# EAGLE design matrixdriver_test_rev1a (EAGLE 4.16)
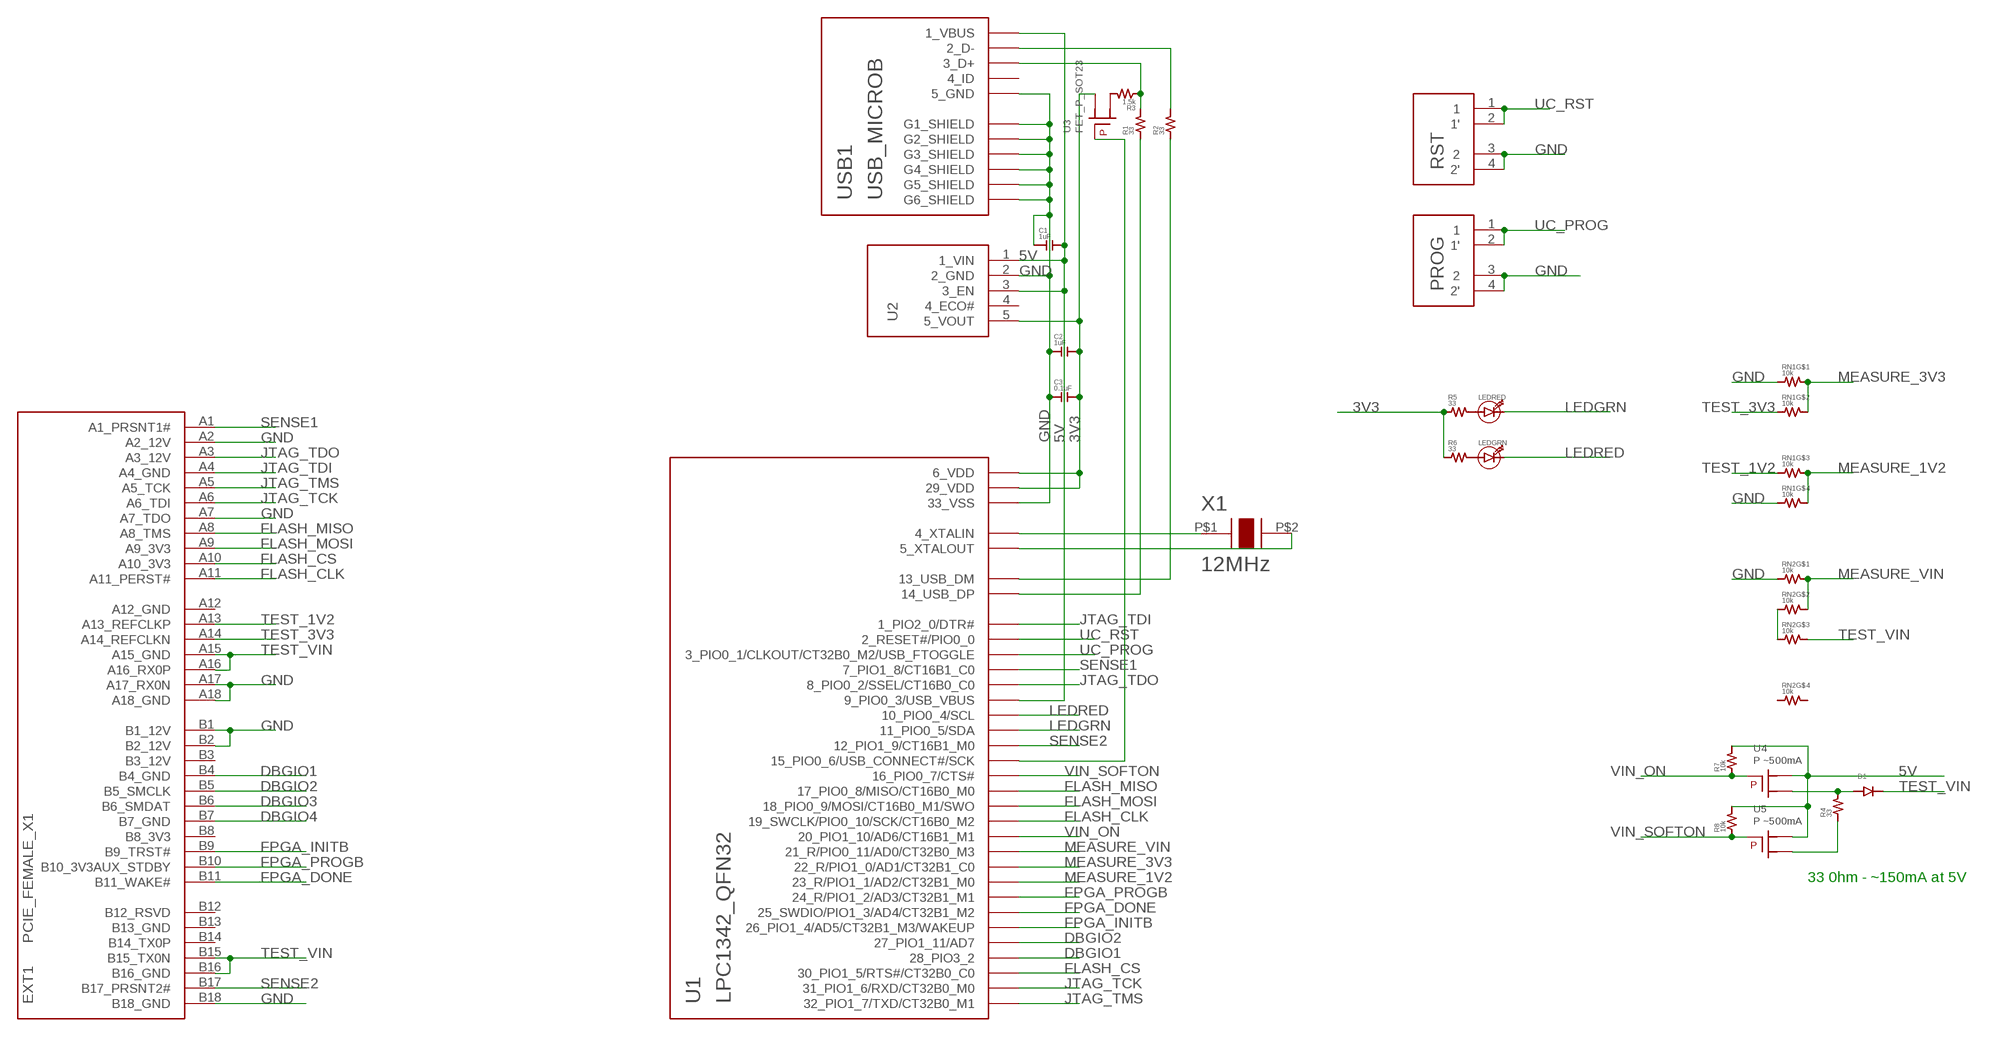
[diagram p0: schematic, sheet 1]

## Parts
C1  1uF  CAP0603  [0603]
C2  1uF  CAP0603  [0603]
C3  0.1uF  CAP0603  [0603]
D1  DIODE0603  [0603_DIODE]
EXT1  PCIE_FEMALE_X1  [PCIE_X1_FEMALE_THROUGHHOLE]
LEDGRN  LED0603  [0603_DIODE]
LEDRED  LED0603  [0603_DIODE]
PROG  SW_SPST4PTS810  [SW_PTS810]
R1  33  RES0603  [0603]
R2  33  RES0603  [0603]
R3  1.5k  RES0603  [0603]
R4  33  RES0603  [0603]
R5  33  RES0603  [0603]
R6  33  RES0603  [0603]
R7  10k  RES0603  [0603]
R8  10k  RES0603  [0603]
RN1  10k  RN4YC164  [RN4_YC164]
RN2  10k  RN4YC164  [RN4_YC164]
RST  SW_SPST4PTS810  [SW_PTS810]
U1  LPC1342_QFN32  [QFN32PAD_.65MM_7X7]
U2  VREG_LDO  [SOT-23-5]
U3  FET_P_SOT23  [SOT-23-3-FET]
U4  P ~500mA  FET_P_SOT23  [SOT-23-3-FET]
U5  P ~500mA  FET_P_SOT23  [SOT-23-3-FET]
USB1  USB_MICROB  [USB_MICROB_FEMALE_FCI_10103594]
X1  12MHz  CRYSTAL5MM_3.2MM  [X_5MM_3.2MM]

## Nets
3V3: C2.2 C3.2 R5.1 R6.1 U1.6(6_VDD) U1.29(29_VDD) U2.5(5_VOUT) U3.S
5V: C1.2 R7.2 R8.2 U1.9(9_PIO0_3/USB_VBUS) U2.1(1_VIN) U2.3(3_EN) U4.S U5.S USB1.1(1_VBUS)
DBGIO1: EXT1.B4(B4_GND) U1.28(28_PIO3_2)
DBGIO2: EXT1.B5(B5_SMCLK) U1.27(27_PIO1_11/AD7)
DBGIO3: EXT1.B6(B6_SMDAT)
DBGIO4: EXT1.B7(B7_GND)
FLASH_CLK: EXT1.A11(A11_PERST#) U1.19(19_SWCLK/PIO0_10/SCK/CT16B0_M2)
FLASH_CS: EXT1.A10(A10_3V3) U1.30(30_PIO1_5/RTS#/CT32B0_C0)
FLASH_MISO: EXT1.A8(A8_TMS) U1.17(17_PIO0_8/MISO/CT16B0_M0)
FLASH_MOSI: EXT1.A9(A9_3V3) U1.18(18_PIO0_9/MOSI/CT16B0_M1/SWO)
FPGA_DONE: EXT1.B11(B11_WAKE#) U1.25(25_SWDIO/PIO1_3/AD4/CT32B1_M2)
FPGA_INITB: EXT1.B9(B9_TRST#) U1.26(26_PIO1_4/AD5/CT32B1_M3/WAKEUP)
FPGA_PROGB: EXT1.B10(B10_3V3AUX_STDBY) U1.24(24_R/PIO1_2/AD3/CT32B1_M1)
GND: C1.1 C2.1 C3.1 EXT1.A2(A2_12V) EXT1.A7(A7_TDO) EXT1.A17(A17_RX0N) EXT1.A18(A18_GND) EXT1.B1(B1_12V) EXT1.B2(B2_12V) EXT1.B18(B18_GND) PROG.3 PROG.4(2') RN1.P$1 RN1.P$4 RN2.P$1 RST.3 RST.4(2') U1.33(33_VSS) U2.2(2_GND) USB1.5(5_GND) USB1.G1(G1_SHIELD) USB1.G2(G2_SHIELD) USB1.G3(G3_SHIELD) USB1.G4(G4_SHIELD) USB1.G5(G5_SHIELD) USB1.G6(G6_SHIELD)
JTAG_TCK: EXT1.A6(A6_TDI) U1.31(31_PIO1_6/RXD/CT32B0_M0)
JTAG_TDI: EXT1.A4(A4_GND) U1.1(1_PIO2_0/DTR#)
JTAG_TDO: EXT1.A3(A3_12V) U1.8(8_PIO0_2/SSEL/CT16B0_C0)
JTAG_TMS: EXT1.A5(A5_TCK) U1.32(32_PIO1_7/TXD/CT32B0_M1)
LEDGRN: LEDRED.- U1.11(11_PIO0_5/SDA)
LEDRED: LEDGRN.- U1.10(10_PIO0_4/SCL)
MEASURE_1V2: RN1.P$5 RN1.P$6 U1.23(23_R/PIO1_1/AD2/CT32B1_M0)
MEASURE_3V3: RN1.P$7 RN1.P$8 U1.22(22_R/PIO1_0/AD1/CT32B1_C0)
MEASURE_VIN: RN2.P$7 RN2.P$8 U1.21(21_R/PIO0_11/AD0/CT32B0_M3)
N$1: R3.2 U3.D
N$2: R2.2 USB1.2(2_D-)
N$3: R1.2 R3.1 USB1.3(3_D+)
N$4: U1.15(15_PIO0_6/USB_CONNECT#/SCK) U3.G
N$5: R2.1 U1.13(13_USB_DM)
N$6: R1.1 U1.14(14_USB_DP)
N$7: LEDRED.+ R5.2
N$8: U1.4(4_XTALIN) X1.P$1
N$9: U1.5(5_XTALOUT) X1.P$2
N$10: LEDGRN.+ R6.2
N$11: D1.+ R4.2 U4.D
N$13: R4.1 U5.D
N$17: RN2.P$2 RN2.P$3
SENSE1: EXT1.A1(A1_PRSNT1#) U1.7(7_PIO1_8/CT16B1_C0)
SENSE2: EXT1.B17(B17_PRSNT2#) U1.12(12_PIO1_9/CT16B1_M0)
TEST_1V2: EXT1.A13(A13_REFCLKP) RN1.P$3
TEST_3V3: EXT1.A14(A14_REFCLKN) RN1.P$2
TEST_VIN: D1.- EXT1.A15(A15_GND) EXT1.A16(A16_RX0P) EXT1.B15(B15_TX0N) EXT1.B16(B16_GND) RN2.P$6
UC_PROG: PROG.1 PROG.2(1') U1.3(3_PIO0_1/CLKOUT/CT32B0_M2/USB_FTOGGLE)
UC_RST: RST.1 RST.2(1') U1.2(2_RESET#/PIO0_0)
VIN_ON: R7.1 U1.20(20_PIO1_10/AD6/CT16B1_M1) U4.G
VIN_SOFTON: R8.1 U1.16(16_PIO0_7/CTS#) U5.G
Unconnected: EXT1.A12(A12_GND) EXT1.B3(B3_12V) EXT1.B8(B8_3V3) EXT1.B12(B12_RSVD) EXT1.B13(B13_GND) EXT1.B14(B14_TX0P) RN2.P$4 RN2.P$5 U2.4(4_ECO#) USB1.4(4_ID)

## Notes on the sheet
- 33 0hm - ~150mA at 5V

## Library data of the parts
C1-C3 = _sg_lib:CAP0603
D1 = _sg_lib:DIODE0603
EXT1 = _sg_lib:PCIE_FEMALE_X1
LEDGRN LEDRED = _sg_lib:LED0603
PROG RST = _sg_lib:SW_SPST4
R1-R8 = _sg_lib:RES0603
RN1 RN2 = _sg_lib:RN4
U1 = _sg_lib:LPC1342_QFN32
U2 = _sg_lib:VREG_LDO
U3-U5 = _sg_lib:FET_P_SOT23
USB1 = _sg_lib:USB_MICROB
X1 = _sg_misc:CRYSTAL

## Board
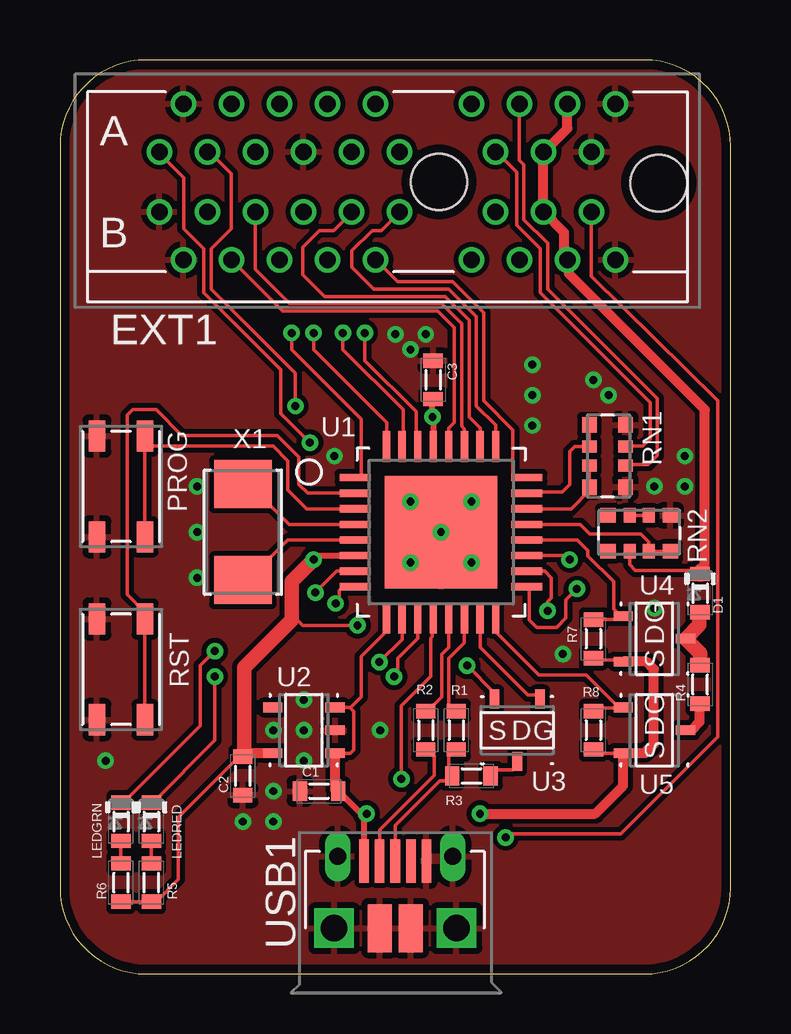
[diagram p1: board, top side]
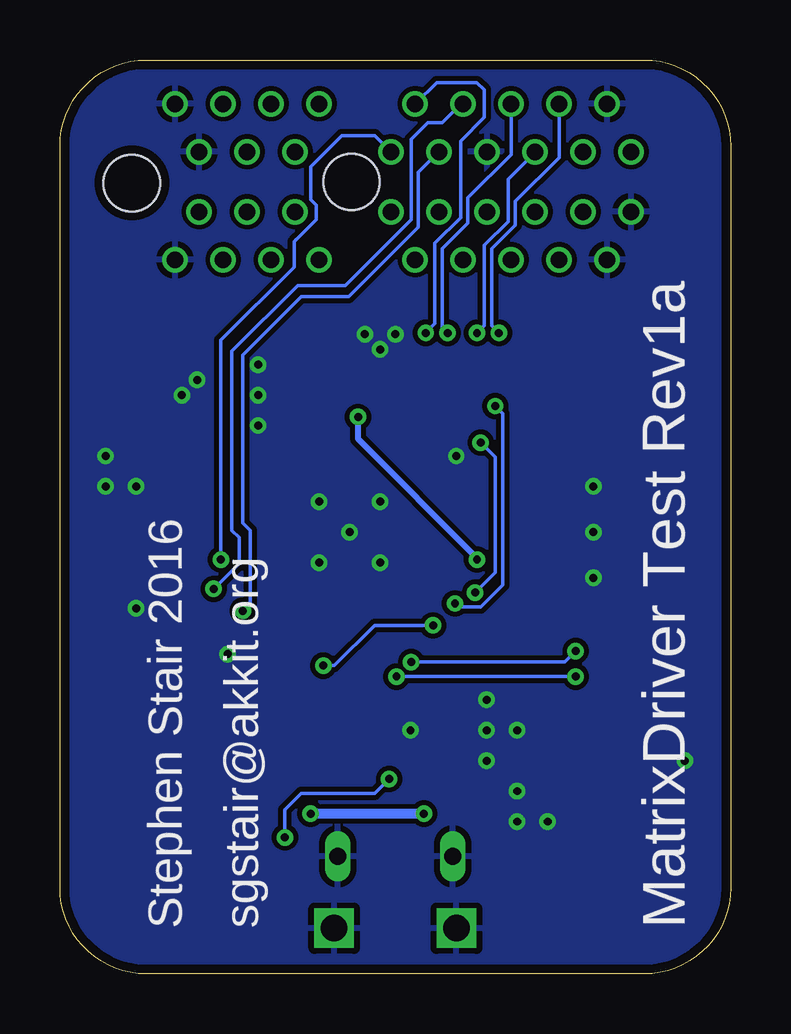
[diagram p2: board, bottom side, seen from below]

Size 27.94 x 38.1 mm. Coordinates in mm from the lower left corner, seen from the top.
Outline: 24.35,0 arc90 27.94,3.59 27.94,34.51 arc90 24.35,38.1 3.59,38.1 arc90 0,34.51 0,3.59 arc90 3.59,0 24.35,0
Copper layers (1*16): Top 0.0356mm / dielectric 1.5011mm / Bottom 0.0356mm
Design rules "LaenPCBOrder": minimum track width 6mil, minimum drill 13mil, track to track 6mil, track to pad 6mil, pad to pad 6mil, via to via 6mil, smd to smd 6mil, copper to edge 15mil, drill to drill 6mil, minimum pad ring 7mil, minimum via ring 7mil, stop-mask expansion 4mil, vias tented up to drill 25mil, thermal gap 10mil
tRestrict: area 18.3,18 to 18.6,18.7; area 13.2,18.2 to 13.4,18.8; area 15.6,20.9 to 16.3,21.2; area 15.7,15.7 to 16.2,15.8; area 18.3,15.6 to 18.7,16; area 13.2,15.7 to 13.5,16

### Footprints (pad centres in the part's own frame; a part is rotated, then mirrored left to right if it is on the bottom)
0603 = smd 0.6 x 0.8: 1 -0.8,0; 2 0.8,0
0603_DIODE = smd 0.6 x 0.8: + 0.8,0; - -0.8,0
PCIE_X1_FEMALE_THROUGHHOLE = drill 0.7 round: A1 -13,1.25; A2 -12,3.25; A3 -11,1.25; A4 -10,3.25; A5 -9,1.25; A6 -8,3.25; A7 -7,1.25; A8 -6,3.25; A9 -5,1.25; A10 -4,3.25; A11 -3,1.25; A12 0,3.25; A13 1,1.25; A14 2,3.25; A15 3,1.25; A16 4,3.25; A17 5,1.25; A18 6,3.25; B1 -13,-1.25; B2 -12,-3.25; B3 -11,-1.25; B4 -10,-3.25; B5 -9,-1.25; B6 -8,-3.25; B7 -7,-1.25; B8 -6,-3.25; B9 -5,-1.25; B10 -4,-3.25; B11 -3,-1.25; B12 0,-3.25; B13 1,-1.25; B14 2,-3.25; B15 3,-1.25; B16 4,-3.25; B17 5,-1.25; B18 6,-3.25 | hole 2.35: -1.35,0; 7.8,-0.05
SW_PTS810 = smd 1.3 x 0.7: 1 -2.1,1; 2 2.1,1; 3 -2.1,-1; 4 2.1,-1
RN4_YC164 = smd 0.65 x 0.6: P$1 -1.3,-0.7; P$4 1.3,-0.7; P$5 1.3,0.8; P$8 -1.3,0.8 | smd 0.5 x 0.6: P$2 -0.4,-0.7; P$3 0.4,-0.7; P$6 0.4,0.8; P$7 -0.4,0.8
QFN32PAD_.65MM_7X7 = smd 1.3 x 0.3: 1 -3.575,2.275; 2 -3.575,1.625; 3 -3.575,0.975; 4 -3.575,0.325; 5 -3.575,-0.325; 6 -3.575,-0.975; 7 -3.575,-1.625; 8 -3.575,-2.275; 17 3.575,-2.275; 18 3.575,-1.625; 19 3.575,-0.975; 20 3.575,-0.325; 21 3.575,0.325; 22 3.575,0.975; 23 3.575,1.625; 24 3.575,2.275 | smd 0.3 x 1.3: 9 -2.275,-3.575; 10 -1.625,-3.575; 11 -0.975,-3.575; 12 -0.325,-3.575; 13 0.325,-3.575; 14 0.975,-3.575; 15 1.625,-3.575; 16 2.275,-3.575; 25 2.275,3.575; 26 1.625,3.575; 27 0.975,3.575; 28 0.325,3.575; 29 -0.325,3.575; 30 -0.975,3.575; 31 -1.625,3.575; 32 -2.275,3.575 | smd 4.7 x 4.7: 33 0,0
SOT-23-5 = smd 0.8 x 0.4: 1 -1.3,0.95; 2 -1.3,0; 3 -1.3,-0.95; 4 1.3,-0.95; 5 1.3,0.95
SOT-23-3-FET = smd 0.8 x 0.4: D 1.3,0; G -1.3,0.95; S -1.3,-0.95
USB_MICROB_FEMALE_FCI_10103594 = smd 0.4 x 1.8: 1 -1.3,2.8; 2 -0.65,2.8; 3 0,2.8; 4 0.65,2.8; 5 1.3,2.8 | drill 0.7 long: G1 -2.4,3; G2 2.4,3 | smd 1 x 2: G3 -0.65,0; G4 0.65,0 | drill 1.1 square: G5 -2.55,0; G6 2.55,0
X_5MM_3.2MM = smd 2 x 2.4: P$1 -2,0; P$2 2,0

### Placement (x,y rotation side)
C1  10.8,7.62 0 top
C2  7.62,8.26 90 top
C3  15.54,24.77 270 top
D1  26.67,15.88 270 top
EXT1  17.15,33.02 0 top
LEDGRN  2.54,6.35 270 top
LEDRED  3.81,6.35 270 top
PROG  2.54,20.32 270 top
R1  16.51,10.16 270 top
R2  15.24,10.16 270 top
R3  17.15,8.26 0 top
R4  26.67,12.07 90 top
R5  3.81,3.81 90 top
R6  2.54,3.81 90 top
R7  22.23,13.97 270 top
R8  22.23,10.16 270 top
RN1  22.86,21.59 90 top
RN2  24.13,18.41 180 top
RST  2.54,12.7 270 top
U1  15.88,18.41 0 top
U2  10.16,10.16 180 top
U3  19.05,10.16 270 top
U4  24.77,13.97 0 top
U5  24.77,10.16 0 top
USB1  13.97,1.91 0 top
X1  7.62,18.41 270 top

### Tracks (layer width: path | path; a pad name or v marks a point on that pad's centre or on a via)
3V3  (via drill 0.33)
  Top 0.152: R6.1 3.72,3.01 3.79,2.95 3.81,2.97 R5.1 4,3.01 4.93,3.94 4.93,6.53 7.45,9.05 C2.2 | U3.S 18.1,11.72 v16.97,12.85 | 9.65,14.83 9.8,14.83 10.11,14.53 v12.4,14.53
  Top 0.254: U1.6 10.73,17.44 v10.57,17.27 | C3.2 15.28,23.97 15.29,23.98 15.52,23.75 15.52,23.29 | v15.52,23.22 15.52,23.29 | U1.29 15.55,23.26 15.52,23.29
  Top 0.406: C2.2 7.62,9.09 7.59,9.12 7.69,9.21 U2.5
  Top 0.61: v10.57,17.27 9.65,16.36 9.65,14.83 9.65,14.76 7.67,12.78 7.67,9.27 7.62,9.22 C2.2
  Bottom 0.152: v16.97,12.85 16.51,12.85 14.83,14.53 v12.4,14.53
  Bottom 0.254: v10.57,17.27 10.57,17.35 15.52,22.3 v15.52,23.22
5V  (via drill 0.33)
  Top 0.152: U2.3 12.08,11.11 12.09,11.1 | 12.09,11.1 12.24,10.95 12.24,9.35 12.09,9.2 11.71,9.2 11.69,9.21 U2.1 | U1.9 13.6,14.29 12.55,13.23 12.55,11.56 12.09,11.1 | R7.2 22.44,13.17 22.53,13.08 23.37,13.08 23.44,13.01 U4.S | R8.2 22.29,9.36 22.45,9.2 23.44,9.2 U5.S
  Top 0.254: C1.2 11.61,7.62 12.62,6.6 12.67,6.56 USB1.1
  Top 0.406: C1.2 11.56,7.59 11.46,7.69 U2.1 | U4.S 24.42,13.02 24.74,12.7 24.74,9.58 24.37,9.21 U5.S 23.47,7.84 22.3,6.68 v17.5,6.68 | v12.78,6.68 12.7,6.68 12.62,6.6
  Bottom 0.406: v12.78,6.68 v17.5,6.68
DBGIO1
  Top 0.152: U1.28 16.2,22.75 16.43,22.99 16.43,26.95 15.75,27.63 9.27,27.63 7.14,29.77 EXT1.B4
DBGIO2
  Top 0.152: U1.27 16.85,22.72 16.74,22.84 16.74,27.1 15.9,27.94 9.58,27.94 8.13,29.39 8.13,31.67 8.15,31.69 EXT1.B5
FLASH_CLK  (via drill 0.33)
  Top 0.152: U1.19 21.07,17.44 v21.23,17.27
  Bottom 0.152: EXT1.A11 14.83,34.95 16.2,34.95 17.5,33.66 17.5,32.28 17.27,32.05 17.27,31.45 18.03,30.68 | 18.03,30.68 18.11,30.61 | v21.23,17.27 21.23,26.42 18.19,29.46 18.19,30.53 18.03,30.68
FLASH_CS  (via drill 0.33)
  Top 0.152: v12.7,26.72 12.7,25.58 14.83,23.44 14.83,21.84 14.9,21.91 U1.30
  Bottom 0.152: EXT1.A10 13.13,36.27 12.24,37.16 10.57,37.16 10.26,36.86 10.26,35.71 11.25,34.72 11.25,31.52 12.32,30.45 12.32,27.1 v12.7,26.72
FLASH_MISO  (via drill 0.33)
  Top 0.152: 19.57,16.14 U1.17 | 19.57,16.14 19.93,16.14 | 19.57,16.14 19.56,16.13 19.56,14.76 19.86,14.45 20.7,14.45 21.08,14.83 21.08,15.6 v21.54,16.05
  Bottom 0.152: EXT1.A8 11.23,36.27 12.01,35.48 12.62,35.48 13.31,34.8 13.31,31.45 16.05,28.7 18.03,28.7 20.78,25.96 20.78,18.49 20.47,18.19 20.47,17.12 v21.54,16.05
FLASH_MOSI  (via drill 0.33)
  Top 0.152: U1.18 20.19,16.79 20.47,16.51 20.47,15.67 20.32,15.52 v20.32,15.14
  Bottom 0.152: EXT1.A9 13.01,33.43 13.01,31.14 15.9,28.25 17.88,28.25 20.32,25.81 20.32,18.8 20.02,18.49 20.02,15.44 v20.32,15.14
FPGA_DONE
  Top 0.152: U1.25 18.15,22.87 17.35,23.67 17.35,27.41 16.2,28.55 13.08,28.55 12.17,29.46 12.17,30.15 13.01,30.99 13.39,30.99 14.15,31.75 EXT1.B11
FPGA_INITB
  Top 0.152: U1.26 17.5,22.76 17.04,23.22 17.04,27.25 16.05,28.25 11.02,28.25 10.11,29.16 10.11,30.3 10.8,30.99 11.41,30.99 12.17,31.75 EXT1.B9
FPGA_PROGB
  Top 0.152: U1.24 18.87,20.69 18.87,22.68 17.65,23.9 17.65,27.56 16.36,28.85 14.07,28.85 EXT1.B10
GND  (via drill 0.33)
  other vias: 19.69,25.4 19.69,24.13 19.69,22.86 22.86,24.13 22.23,24.77 24.77,20.32 26.04,20.32 26.04,21.59 14.61,17.15 17.15,17.15 17.15,19.69 14.61,19.69 15.88,18.41 10.16,8.89 10.16,10.16 10.16,11.43 8.89,10.16 8.89,7.62 8.89,6.35 7.62,6.35 1.91,8.89 5.71,20.32 5.71,18.41 5.71,16.51 15.24,26.67 13.97,26.67 14.61,26.04 13.34,10.16 11.43,21.59 20.95,13.34 24.77,15.24
  pour Top (isolate 0.203): -0.48,46.61 34.42,46.61 34.42,-5.59 -8.03,-5.59 -8.03,43.26
  pour Bottom (isolate 0.203): 0.28,44.93 32.21,44.93 32.21,-3.45 -5.82,-3.45 -5.82,42.8
JTAG_TCK  (via drill 0.33)
  Top 0.152: v11.79,26.72 11.79,26.04 14.3,23.52 14.3,22.15 14.22,22.07 14.25,22.05 U1.31
  Bottom 0.152: EXT1.A6 9.15,34.16 10.95,32.36 10.95,31.29 12.01,30.23 12.01,26.95 v11.79,26.72
JTAG_TDI  (via drill 0.33)
  Top 0.152: v9.65,26.72 9.65,26.04 12.55,23.14 12.55,20.78 12.46,20.69 U1.1
  Bottom 0.152: EXT1.A4 7.15,34.03 8.97,32.21 8.97,31.22 9.96,30.23 9.96,27.03 v9.65,26.72
JTAG_TDO  (via drill 0.33)
  Top 0.152: U1.8 11.8,16.14 11.63,15.98 11.63,15.6 v11.48,15.44 | v9.8,23.67 9.8,25.04 6.3,28.55 6.3,29.16 | 6.3,29.16 6.3,29.23 | 6.3,29.16 6.3,30.23 7.14,31.06 7.14,33.35 6.22,34.27 EXT1.A3
  Bottom 0.152: v11.48,15.44 11.33,15.29 10.41,15.29 9.5,16.2 9.5,23.37 v9.8,23.67
JTAG_TMS  (via drill 0.33)
  Top 0.152: v10.57,26.72 10.57,26.04 13.61,22.99 13.61,21.92 | 13.61,21.92 13.6,21.94 U1.32 | 13.61,21.92 13.69,21.84
  Bottom 0.152: EXT1.A5 8.15,34.25 9.27,33.12 9.27,31.37 10.26,30.38 10.26,27.03 v10.57,26.72
LEDGRN  (via drill 0.33)
  Top 0.152: U1.11 14.9,13.99 14.07,13.16 14.07,12.55 v13.92,12.4 | LEDRED.- 3.85,7.15 3.86,7.14 6.45,9.73 v6.45,12.4
  Bottom 0.152: v6.45,12.4 v13.92,12.4
LEDRED  (via drill 0.33)
  Top 0.152: U1.10 14.25,13.95 v13.31,13.01 | v6.45,13.46 5.84,12.85 5.84,10.34 2.64,7.14 2.63,7.15 LEDGRN.-
  Bottom 0.152: v13.31,13.01 6.91,13.01 v6.45,13.46
MEASURE_1V2
  Top 0.152: RN1.P$5 22.06,22.09 22.07,22.07 22.06,22.06 RN1.P$6 21.46,21.99 21.23,21.77 21.23,20.4 20.93,20.09 19.56,20.09 19.48,20.02 U1.23
MEASURE_3V3
  Top 0.152: U1.22 21.3,19.39 22.07,20.17 22.06,20.18 RN1.P$8 22.06,20.99 22.07,21.01 22.06,21.02 RN1.P$7
MEASURE_VIN
  Top 0.152: U1.21 21.67,18.74 22.07,18.34 24.21,18.34 24.53,18.02 RN2.P$7 25.39,17.62 25.43,17.65 RN2.P$8
N$1
  Top 0.152: R3.2 17.95,8.34 18.11,8.51 18.87,8.51 19.05,8.69 U3.D
N$2
  Top 0.152: USB1.2 13.32,6.01 15.6,8.28 15.6,9.04 15.28,9.36 R2.2
N$3
  Top 0.152: USB1.3 13.97,6.2 15.82,8.05 16.43,8.05 16.34,8.14 R3.1 16.34,8.37 16.2,8.51 16.2,9.35 16.22,9.36 R1.2
N$4
  Top 0.152: U1.15 17.5,13.62 19.48,11.63 19.86,11.63 20.02,11.48 U3.G
N$5
  Top 0.152: U1.13 16.2,13.61 15.9,13.31 15.9,11.56 15.29,10.95 15.28,10.96 R2.1
N$6
  Top 0.152: U1.14 16.85,13.8 16.2,13.16 16.2,11.25 16.51,10.95 R1.1
N$7
  Top 0.152: R5.2 3.81,4.65 3.86,4.7 3.81,4.75 LEDRED.+
N$8
  Top 0.152: X1.P$1 7.88,20.41 9.56,18.74 U1.4
N$9
  Top 0.152: U1.5 9.48,18.09 8.28,16.89 8.13,16.89 7.62,16.38 | 7.59,16.36 7.62,16.38 | 7.62,16.38 X1.P$2
N$10
  Top 0.152: R6.2 2.63,4.61 2.64,4.62 2.54,4.72 LEDGRN.+
N$11
  Top 0.61: D1.+ 26.65,15.05 26.65,14.55 U4.D 26.67,13.36 R4.2
N$13
  Top 0.406: U5.D 26.31,10.16 26.65,10.49 26.65,11.33 26.67,11.3 R4.1
N$17
  Top 0.152: RN2.P$2 24.59,19.18 | RN2.P$2 | RN2.P$3 RN2.P$2
SENSE1  (via drill 0.33)
  Top 0.152: U1.7 11.53,16.79 v10.64,15.9 | v10.41,22.15 9.2,23.37 9.2,25.2 5.99,28.4 5.99,30.23 5.16,31.06 5.16,33.2 4.09,34.27 4.1,34.27 EXT1.A1
  Bottom 0.152: v10.64,15.9 9.8,16.74 9.8,21.54 v10.41,22.15
SENSE2  (via drill 0.33)
  Top 0.152: EXT1.B17 22.15,29.09 27.41,23.9 27.41,9.88 23.37,5.84 18.72,5.84 v18.57,5.69 | v14.22,8.13 14.22,11.18 15.44,12.4 15.44,14 15.52,14.07 15.52,14.76 15.55,14.79 U1.12
  Bottom 0.152: v18.57,5.69 18.57,6.83 17.88,7.52 14.83,7.52 v14.22,8.13
TEST_1V2
  Top 0.152: EXT1.A13 18.18,34.27 19.02,33.43 19.02,31.22 20.02,30.23 20.02,28.4 24.59,23.83 24.59,22.3 24.28,22 23.6,22 23.56,21.96 | 23.56,21.96 23.52,21.92 | RN1.P$3 23.56,21.96
TEST_3V3
  Top 0.152: EXT1.A14 19.15,33.92 19.33,33.73 19.33,31.45 20.32,30.45 20.32,28.55 24.89,23.98 24.89,21.62 24.51,21.23 23.67,21.23 23.6,21.16 RN1.P$2
TEST_VIN
  Top 0.152: RN2.P$6 23.73,17.06 23.98,16.82 26.72,16.82 26.87,16.82 26.72,16.66 26.65,16.66
  Top 0.406: 26.87,16.82 26.87,23.52 21.23,29.16 | 21.23,29.16 EXT1.B16 | 21.23,29.16 21.01,29.92 21.01,30.91 EXT1.B15 20.15,31.85 20.09,31.9 20.15,31.96 EXT1.A15 20.17,34.27 21.15,35.24 EXT1.A16
  Top 0.61: 26.72,16.82 26.72,16.66 26.71,16.68 D1.- 26.66,16.68 26.65,16.66
UC_PROG
  Top 0.152: 3.51,22.42 3.48,22.45 | 3.51,22.42 PROG.1 3.54,22.16 3.71,22 8.89,22 9.5,21.39 9.5,20.17 10.28,19.39 U1.3 | PROG.2 3.54,22.39 3.51,22.42
UC_RST
  Top 0.152: RST.2 3.54,14.59 3.71,14.76 3.67,14.8 RST.1 3.54,15.08 2.79,15.82 2.79,23.29 3.02,23.52 4.01,23.52 5.08,22.45 9.04,22.45 9.96,21.54 9.96,20.4 10.31,20.04 U1.2
VIN_ON
  Top 0.152: U1.20 21.56,18.09 22,17.65 22,17.42 23.06,16.36 23.06,15.22 23.37,14.91 23.38,14.92 | 23.38,14.92 U4.G | R7.1 23.23,14.77 23.38,14.92
VIN_SOFTON
  Top 0.152: U1.16 18.15,14.26 19.94,12.47 21.92,12.47 23.29,11.1 23.3,11.11 U5.G 23.45,11.11 23.44,11.1 22.45,11.1 22.31,10.96 R8.1

### Text on the board
bPlace: MatrixDriver Test Rev1a | sgstair@akkit.org | Stephen Stair 2016